# EAGLE design Excelsior488nm_Controller_Schematic (EAGLE 9.4.2)
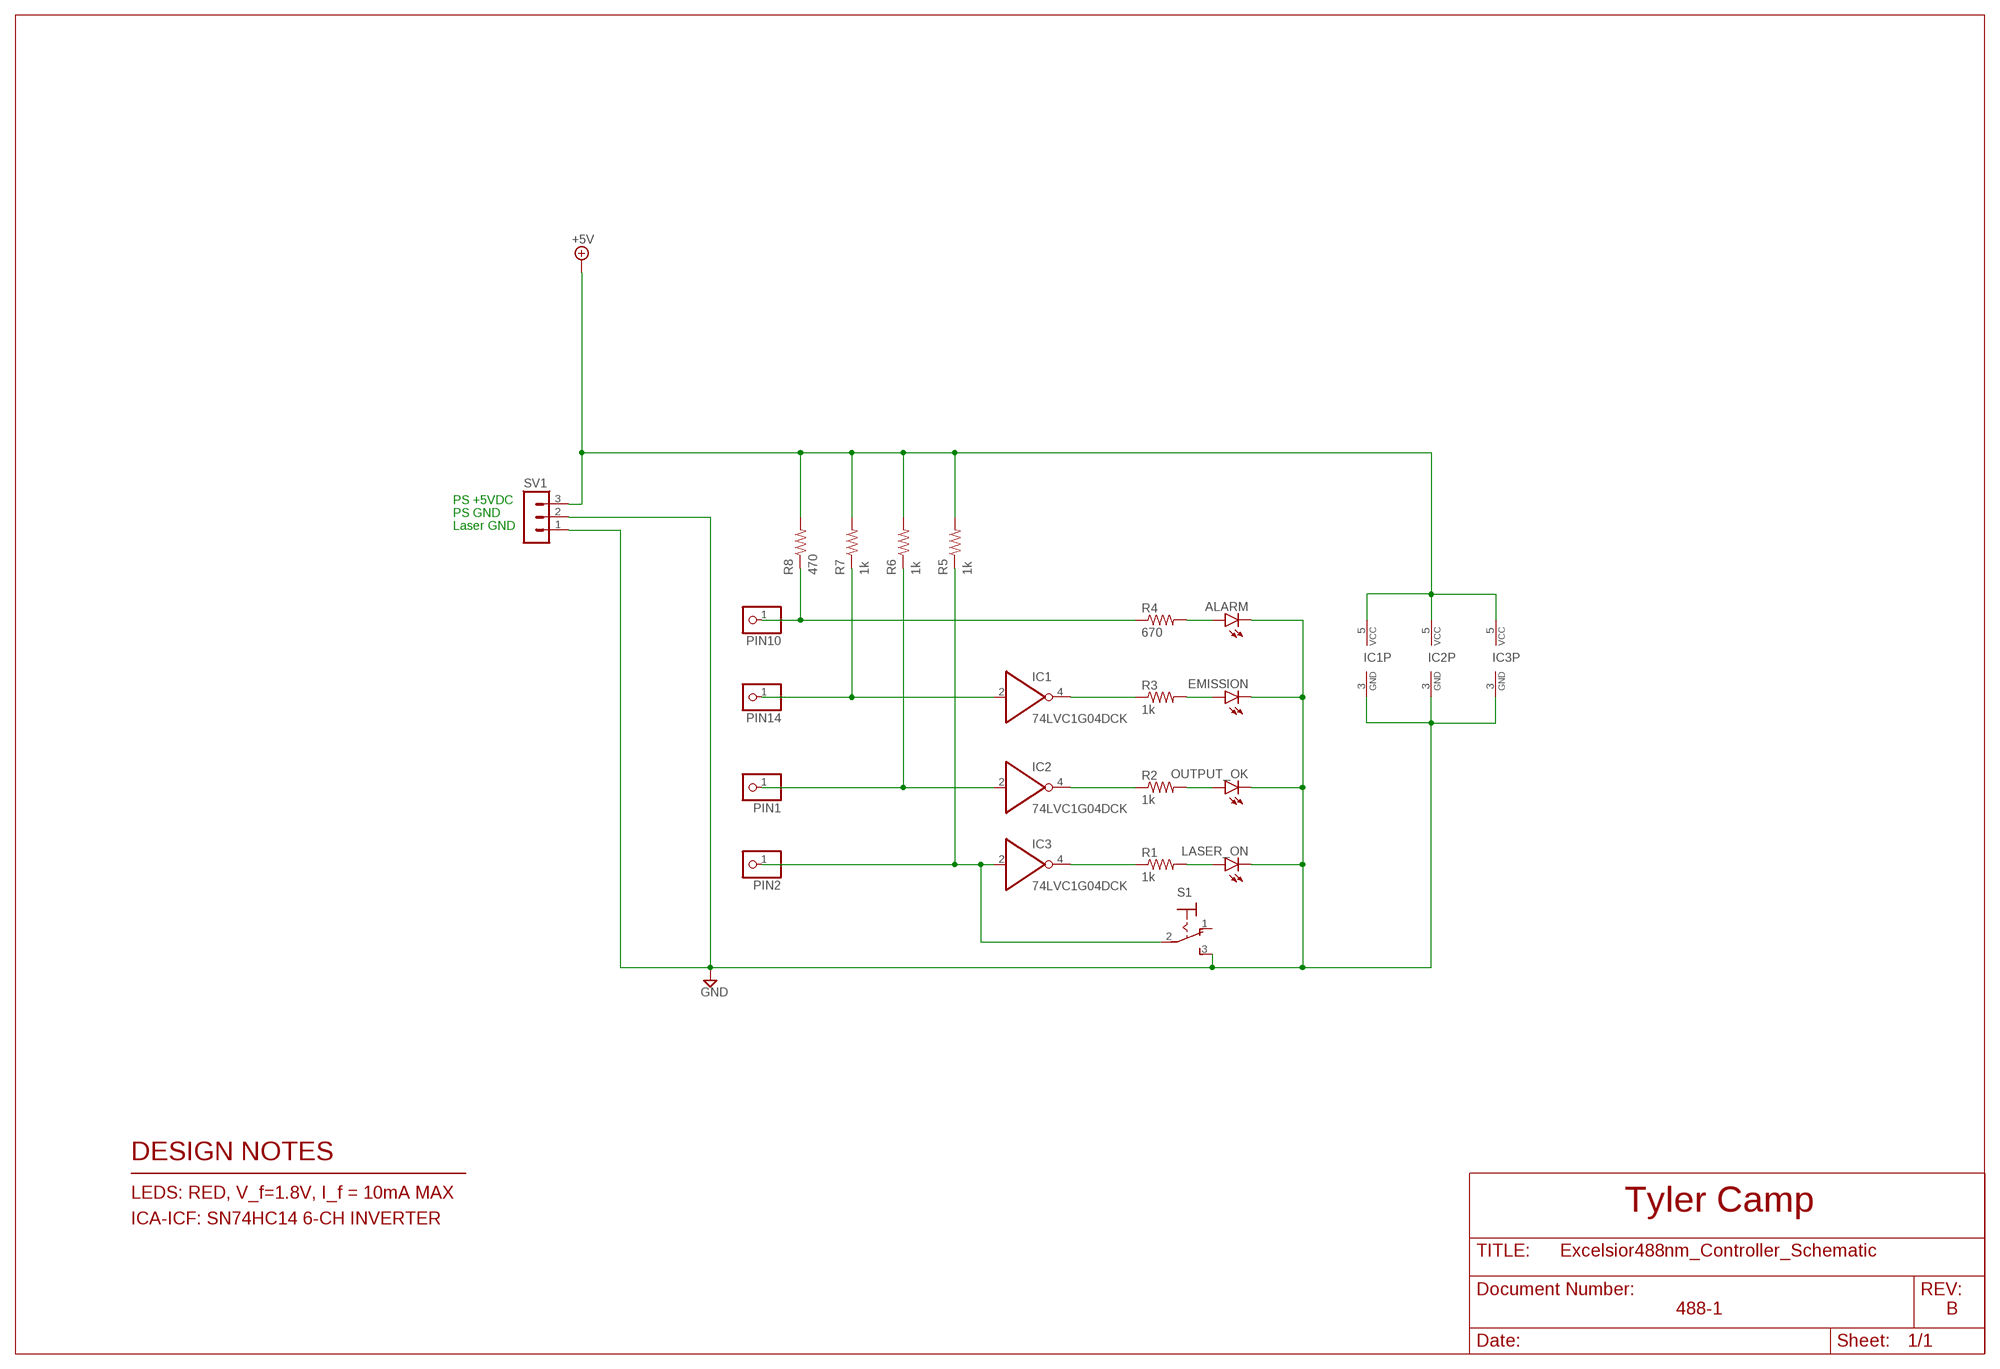
[diagram p0: schematic, sheet 1]

## Parts
ALARM  LED3MM  [LED3MM]
EMISSION  LED3MM  [LED3MM]
IC1  74LVC1G04DCK  [SC70-5]
IC2  74LVC1G04DCK  [SC70-5]
IC3  74LVC1G04DCK  [SC70-5]
LASER_ON  LED3MM  [LED3MM]
OUTPUT_OK  LED3MM  [LED3MM]
PIN1  PINHD-1X1  [1X01]
PIN2  PINHD-1X1  [1X01]
PIN10  PINHD-1X1  [1X01]
PIN14  PINHD-1X1  [1X01]
R1  1k  R-US_R0603  [R0603]
R2  1k  R-US_R0603  [R0603]
R3  1k  R-US_R0603  [R0603]
R4  670  R-US_R0603  [R0603]
R5  1k  R-US_R0603  [R0603]
R6  1k  R-US_R0603  [R0603]
R7  1k  R-US_R0603  [R0603]
R8  470  R-US_R0603  [R0603]
S1  M9040P  [M9040P]
SV1  MA03-1  [MA03-1]

## Nets
+5V: IC1.5(VCC) IC2.5(VCC) IC3.5(VCC) R5.2 R6.2 R7.2 R8.2 SV1.3
GND: ALARM.K(C) EMISSION.K(C) IC1.3(GND) IC2.3(GND) IC3.3(GND) LASER_ON.K(C) OUTPUT_OK.K(C) S1.3(S) SV1.1 SV1.2
N$1: IC1.4(O) R3.1
N$2: IC1.2(I) PIN14.1 R7.1
N$3: IC2.2(I) PIN1.1 R6.1
N$6: LASER_ON.A R1.2
N$7: IC3.4(O) R1.1
N$8: IC2.4(O) R2.1
N$9: PIN10.1 R4.1 R8.1
N$10: ALARM.A R4.2
N$11: EMISSION.A R3.2
N$12: OUTPUT_OK.A R2.2
PIN2: IC3.2(I) PIN2.1 R5.1 S1.2(P)
Unconnected: S1.1(O)

## Notes on the sheet
- PS +5VDC
- PS GND
- Laser GND
- DESIGN NOTES
- LEDS: RED, V_f=1.8V, I_f = 10mA MAX
- Tyler Camp
- ICA-ICF: SN74HC14 6-CH INVERTER
- 488-1 | B

## Library data of the parts
ALARM EMISSION LASER_ON OUTPUT_OK = led:LED: LED OSRAM: - CHIPLED LG R971, LG N971, LY N971, LG Q971, LY Q971, LO R971, LY R971 LH N974, LH R974 LS Q976, LO Q976, LY Q976 LO Q996 - Hyper CHIPLED LW Q18S LB Q993, LB Q99A, LB R99A - SideLED LS A670, LO A670, LY A670, LG A670, LP A670 LB A673, LV A673, LT A673, LW A673 LH A674 LY A675 LS A676, LA A676, LO A676, LY A676, LW A676 LS A679, LY A679, LG A679 - Hyper Micro SIDELED® LS Y876, LA Y876, LO Y876, LY Y876 LT Y87S - SmartLED LW L88C, LW L88S LB L89C, LB L89S, LG L890 LS L89K, LO L89K, LY L89K LS L896, LA L896, LO L896, LY L896 - TOPLED LS T670, LO T670, LY T670, LG T670, LP T670 LSG T670, LSP T670, LSY T670, LOP T670, LYG T670 LG T671, LOG T671, LSG T671 LB T673, LV T673, LT T673, LW T673 LH T674 LS T676, LA T676, LO T676, LY T676, LB T676, LH T676, LSB T676, LW T676 LB T67C, LV T67C, LT T67C, LS T67K, LO T67K, LY T67K, LW E67C LS E67B, LA E67B, LO E67B, LY E67B, LB E67C, LV E67C, LT E67C LW T67C LS T679, LY T679, LG T679 LS T770, LO T770, LY T770, LG T770, LP T770 LB T773, LV T773, LT T773, LW T773 LH T774 LS E675, LA E675, LY E675, LS T675 LS T776, LA T776, LO T776, LY T776, LB T776 LHGB T686 LT T68C, LB T68C - Hyper Mini TOPLED® LB M676 - Mini TOPLED Santana® LG M470 LS M47K, LO M47K, LY M47K Source: http://www.osram.convergy.de LUXEON: - LUMILED® LXK2-PW12-R00, LXK2-PW12-S00, LXK2-PW14-U00, LXK2-PW14-V00 LXK2-PM12-R00, LXK2-PM12-S00, LXK2-PM14-U00 LXK2-PE12-Q00, LXK2-PE12-R00, LXK2-PE12-S00, LXK2-PE14-T00, LXK2-PE14-U00 LXK2-PB12-K00, LXK2-PB12-L00, LXK2-PB12-M00, LXK2-PB14-N00, LXK2-PB14-P00, LXK2-PB14-Q00 LXK2-PR12-L00, LXK2-PR12-M00, LXK2-PR14-Q00, LXK2-PR14-R00 LXK2-PD12-Q00, LXK2-PD12-R00, LXK2-PD12-S00 LXK2-PH12-R00, LXK2-PH12-S00 LXK2-PL12-P00, LXK2-PL12-Q00, LXK2-PL12-R00 Source: www.luxeon.com KINGBRIGHT: KA-3528ASYC Source: www.kingbright.com
IC1-IC3 = 74xx-little-de:74*1G04: INVERTER Gate
PIN1 PIN2 PIN10 PIN14 = pinhead:PINHD-1X1: PIN HEADER
R1-R8 = rcl:R-US_: RESISTOR, American symbol; SPICEPREFIX: R
S1 = switch:M9040P: TOGGLE SWITCH Marquardt
SV1 = con-lstb:MA03-1: PIN HEADER; OC_FARNELL: unknown; OC_NEWARK: unknown

## Board
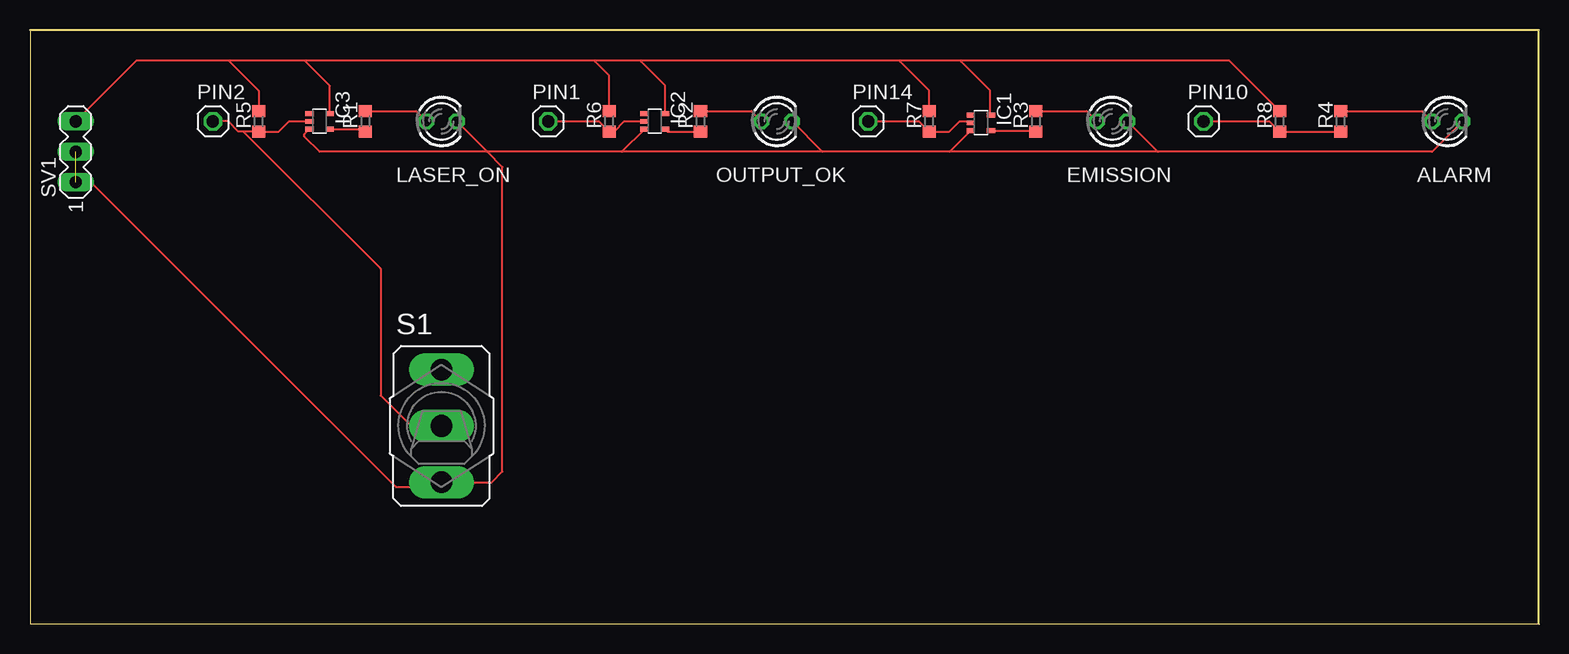
[diagram p1: board, top side]

Size 125.73 x 49.53 mm. Coordinates in mm from the lower left corner, seen from the top.
Outline: 125.73,0 125.73,49.53 0,49.53 0,0 125.73,0
Copper layers (1*16): Top 0.035mm / dielectric 1.5mm / Bottom 0.035mm
Design rules "default": minimum track width 6mil, minimum drill 0.35mm, track to track 6mil, track to pad 6mil, pad to pad 6mil, via to via 6mil, smd to smd 6mil, copper to edge 40mil, drill to drill 6mil, minimum pad ring 10mil, minimum via ring 8mil, stop-mask expansion 4mil, vias tented up to drill 0mil, thermal gap 10mil

### Footprints (pad centres in the part's own frame; a part is rotated, then mirrored left to right if it is on the bottom)
LED3MM = drill 0.813 octagon: A -1.27,0; K 1.27,0
SC70-5 = smd 0.4 x 0.7: 1 -0.65,-0.85; 2 0,-0.85; 3 0.65,-0.85; 4 0.65,0.85; 5 -0.65,0.85
1X01 = drill 1.016 octagon: 1 0,0
R0603 = smd 1 x 1.1: 1 -0.85,0; 2 0.85,0
M9040P = drill 1.803 long: 1 0,4.699; 2 0,0; 3 0,-4.699
MA03-1 = drill 1.016 long: 1 -2.54,0; 2 0,0; 3 2.54,0

### Placement (x,y rotation side)
ALARM  118.11,41.91 0 top
EMISSION  90.17,41.91 0 top
IC1  79.25,41.78 270 top
IC2  52.07,41.91 270 top
IC3  24.13,41.91 270 top
LASER_ON  34.29,41.91 0 top
OUTPUT_OK  62.23,41.91 0 top
PIN1  43.18,41.91 0 top
PIN2  15.24,41.91 0 top
PIN10  97.79,41.91 0 top
PIN14  69.85,41.91 0 top
R1  27.94,41.91 90 top
R2  55.88,41.91 90 top
R3  83.82,41.91 90 top
R4  109.22,41.91 90 top
R5  19.05,41.91 90 top
R6  48.26,41.91 90 top
R7  74.93,41.91 90 top
R8  104.14,41.91 90 top
S1  34.29,16.51 0 top
SV1  3.81,39.37 90 top

### Tracks (layer width: path | path; a pad name or v marks a point on that pad's centre or on a via)
+5V
  Top 0.152: SV1.3 8.89,46.99 16.51,46.99 | R8.2 99.91,46.99 77.47,46.99 | 16.51,46.99 22.86,46.99 | 22.86,46.99 46.99,46.99 | 46.99,46.99 50.8,46.99 | 50.8,46.99 72.39,46.99 | 72.39,46.99 77.47,46.99 | 16.51,46.99 19.05,44.45 R5.2 | IC3.5 24.98,44.87 22.86,46.99 | IC2.5 52.92,44.87 50.8,46.99 | R6.2 48.26,45.72 46.99,46.99 | IC1.5 80.01,42.52 80.01,44.45 77.47,46.99 | R7.2 74.93,44.45 72.39,46.99
GND  (1 unrouted)
  Top 0.152: ALARM.K 116.84,39.37 93.98,39.37 | IC3.3 22.86,40.84 22.86,40.64 24.13,39.37 38.1,39.37 | 93.98,39.37 76.64,39.37 | 76.64,39.37 66.04,39.37 | 66.04,39.37 49.33,39.37 | 49.33,39.37 38.1,39.37 | IC2.3 49.33,39.37 | IC1.3 76.64,39.37 | EMISSION.K 93.98,39.37 | OUTPUT_OK.K 66.04,39.37 | LASER_ON.K 38.1,39.37 | SV1.1 5.08,36.83 30.48,11.43 33.91,11.43 S1.3 38.48,11.81 39.37,12.7 39.37,38.1 38.1,39.37
N$1
  Top 0.152: IC1.4 83.75,41.13 R3.1
N$2
  Top 0.152: IC1.2 78.27,41.91 77.47,41.91 76.62,41.06 R7.1 74.08,41.91 PIN14.1
N$3
  Top 0.152: IC2.2 49.53,41.91 48.68,41.06 R6.1 47.41,41.91 PIN1.1
N$6
  Top 0.152: R1.2 32.17,42.76 LASER_ON.A
N$7
  Top 0.152: IC3.4 27.74,41.26 R1.1
N$8
  Top 0.152: IC2.4 53.12,41.06 R2.1
N$9
  Top 0.152: PIN10.1 103.29,41.91 R8.1 R4.1
N$10
  Top 0.152: R4.2 115.99,42.76 ALARM.A
N$11
  Top 0.152: R3.2 88.05,42.76 EMISSION.A
N$12
  Top 0.152: R2.2 60.11,42.76 OUTPUT_OK.A
PIN2
  Top 0.152: IC3.2 21.59,41.91 20.74,41.06 R5.1 17.78,41.06 | 17.78,41.06 17.36,41.06 16.51,41.91 PIN2.1 | 17.78,41.06 29.21,29.63 29.21,19.05 31.75,16.51 S1.2